# Altium schematic sheet PCB_MCH_mordovia.SchDoc: Mordovia
size 420 x 297 mm; PageSetup: Record=PageOptions|CenterHorizontal=True|CenterVertical=True|PrintScale=0.73|XCorrection==PcbVersion0|YCorrection==PcbVersion0|PrintKind=2|BorderSize=5000000|LeftOffset=0|BottomOffset=0|Orientation=2|PaperLength=1000|PaperWidth=1000|Scale=100|PaperSource=7|PrintQuality=600|MediaType=1|DitherType=10|PaperKind=A4|PrintScaleMode=1; Author: G.K.; CompanyName: WUT; DrawnBy: G.K.; Organization: CERN; Address1: Warsaw Univeristy of Technology; Address2: Nowowiejska 15/19; Revision: -; SheetNumber: -; SheetTotal: -; EDA_Number: ARTIQ; Projet: SINARA; ModifiedBy: -; CreateDate: XX/XX/XXXX; CheckedDate: -; Title2: Tongue 2 adapter; DivGrp: ISE; Designer: G.K.; ModifiedDate: -; ProjectName: SINARA
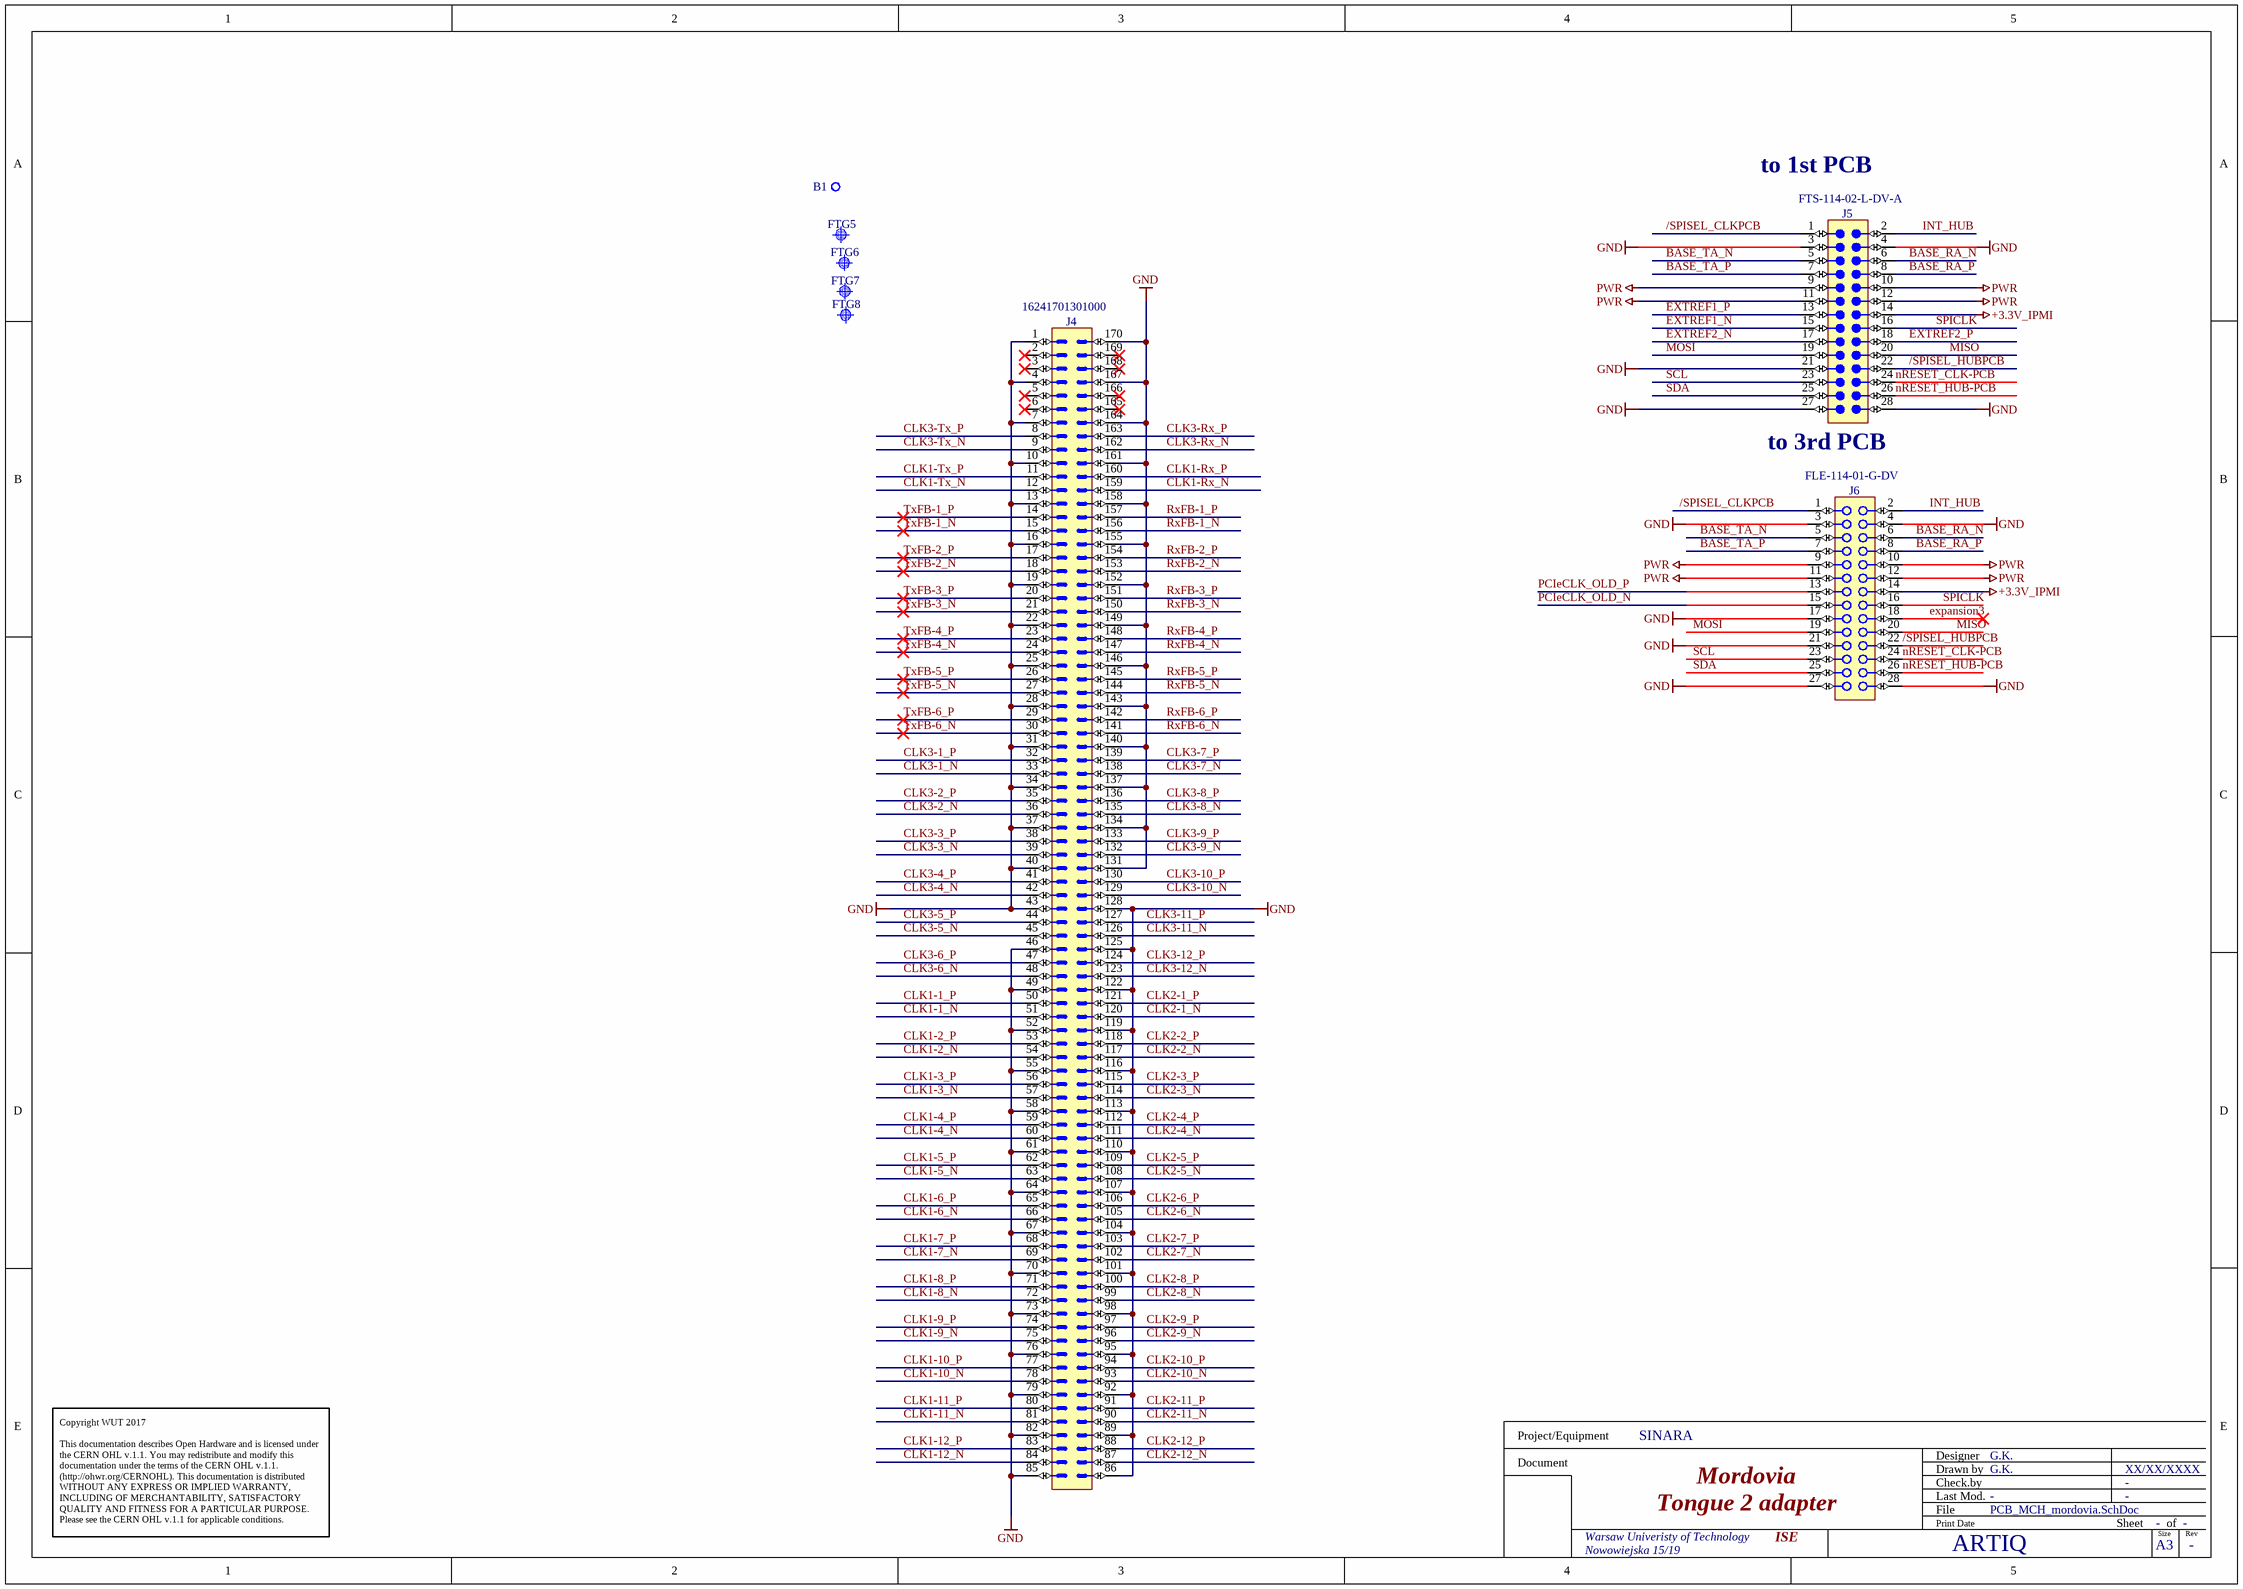
[diagram p0: PCB_MCH_mordovia.SchDoc]

## Parts
B1  Non Plated Hole  [MTG520]  (value not drawn)
FTG5  Use only in PCB  [FIDUCIAL_TOP_C100-200]  (value not drawn)
FTG6  Use only in PCB  [FIDUCIAL_TOP_S100-200]  (value not drawn)
FTG7  Use only in PCB  [FIDUCIAL_TOP_S200-400]  (value not drawn)
FTG8  Use only in PCB  [FIDUCIAL_TOP_S100-200]  (value not drawn)
J4  Manufacturer Part Number: 16241701301000  [ITB_16241701301000]
J5  Manufacturer Part Number: FTS-114-02-L-DV-A  [SAMTEC_FTS-114-02-L-DV-A]  (hidden comment: Header 28)
J6  Manufacturer Part Number: FLE-114-01-G-DV  [SAMTEC_FLE-114-01-G-DV]  (hidden comment: Socket 28)

## Nets
+3.3V_IPMI: J5.14 J6.14
GND: J4.1 J4.4 J4.7 J4.10 J4.13 J4.16 J4.19 J4.22 J4.25 J4.28 J4.31 J4.34 J4.37 J4.40 J4.43 J4.46 J4.49 J4.52 J4.55 J4.58 J4.61 J4.64 J4.67 J4.70 J4.73 J4.76 J4.79 J4.82 J4.85 J4.86 J4.89 J4.92 J4.95 J4.98 J4.101 J4.104 J4.107 J4.110 J4.113 J4.116 J4.119 J4.122 J4.125 J4.128 J4.131 J4.134 J4.137 J4.140 J4.143 J4.146 J4.149 J4.152 J4.155 J4.158 J4.161 J4.164 J4.167 J4.170 J5.3 J5.4 J5.21 J5.27 J5.28 J6.3 J6.4 J6.17 J6.21 J6.27 J6.28
PWR: J5.9 J5.10 J5.11 J5.12 J6.9 J6.10 J6.11 J6.12
/SPISEL_CLKPCB: J5.1 J6.1
/SPISEL_HUBPCB: J5.22 J6.22
BASE_RA_N: J5.6 J6.6
BASE_RA_P: J5.8 J6.8
BASE_TA_N: J5.5 J6.5
BASE_TA_P: J5.7 J6.7
CLK1-1_N: J4.51
CLK1-1_P: J4.50
CLK1-2_N: J4.54
CLK1-2_P: J4.53
CLK1-3_N: J4.57
CLK1-3_P: J4.56
CLK1-4_N: J4.60
CLK1-4_P: J4.59
CLK1-5_N: J4.63
CLK1-5_P: J4.62
CLK1-6_N: J4.66
CLK1-6_P: J4.65
CLK1-7_N: J4.69
CLK1-7_P: J4.68
CLK1-8_N: J4.72
CLK1-8_P: J4.71
CLK1-9_N: J4.75
CLK1-9_P: J4.74
CLK1-10_N: J4.78
CLK1-10_P: J4.77
CLK1-11_N: J4.81
CLK1-11_P: J4.80
CLK1-12_N: J4.84
CLK1-12_P: J4.83
CLK1-Rx_N: J4.159
CLK1-Rx_P: J4.160
CLK1-Tx_N: J4.12
CLK1-Tx_P: J4.11
CLK2-1_N: J4.120
CLK2-1_P: J4.121
CLK2-2_N: J4.117
CLK2-2_P: J4.118
CLK2-3_N: J4.114
CLK2-3_P: J4.115
CLK2-4_N: J4.111
CLK2-4_P: J4.112
CLK2-5_N: J4.108
CLK2-5_P: J4.109
CLK2-6_N: J4.105
CLK2-6_P: J4.106
CLK2-7_N: J4.102
CLK2-7_P: J4.103
CLK2-8_N: J4.99
CLK2-8_P: J4.100
CLK2-9_N: J4.96
CLK2-9_P: J4.97
CLK2-10_N: J4.93
CLK2-10_P: J4.94
CLK2-11_N: J4.90
CLK2-11_P: J4.91
CLK2-12_N: J4.87
CLK2-12_P: J4.88
CLK3-1_N: J4.33
CLK3-1_P: J4.32
CLK3-2_N: J4.36
CLK3-2_P: J4.35
CLK3-3_N: J4.39
CLK3-3_P: J4.38
CLK3-4_N: J4.42
CLK3-4_P: J4.41
CLK3-5_N: J4.45
CLK3-5_P: J4.44
CLK3-6_N: J4.48
CLK3-6_P: J4.47
CLK3-7_N: J4.138
CLK3-7_P: J4.139
CLK3-8_N: J4.135
CLK3-8_P: J4.136
CLK3-9_N: J4.132
CLK3-9_P: J4.133
CLK3-10_N: J4.129
CLK3-10_P: J4.130
CLK3-11_N: J4.126
CLK3-11_P: J4.127
CLK3-12_N: J4.123
CLK3-12_P: J4.124
CLK3-Rx_N: J4.162
CLK3-Rx_P: J4.163
CLK3-Tx_N: J4.9
CLK3-Tx_P: J4.8
expansion3: J6.18
EXTREF1_N: J5.15
EXTREF1_P: J5.13
EXTREF2_N: J5.17
EXTREF2_P: J5.18
INT_HUB: J5.2 J6.2
MISO: J5.20 J6.20
MOSI: J5.19 J6.19
nRESET_CLK-PCB: J5.24 J6.24
nRESET_HUB-PCB: J5.26 J6.26
PCIeCLK_OLD_N: J6.15
PCIeCLK_OLD_P: J6.13
RxFB-1_N: J4.156
RxFB-1_P: J4.157
RxFB-2_N: J4.153
RxFB-2_P: J4.154
RxFB-3_N: J4.150
RxFB-3_P: J4.151
RxFB-4_N: J4.147
RxFB-4_P: J4.148
RxFB-5_N: J4.144
RxFB-5_P: J4.145
RxFB-6_N: J4.141
RxFB-6_P: J4.142
SCL: J5.23 J6.23
SDA: J5.25 J6.25
SPICLK: J5.16 J6.16
TxFB-1_N: J4.15
TxFB-1_P: J4.14
TxFB-2_N: J4.18
TxFB-2_P: J4.17
TxFB-3_N: J4.21
TxFB-3_P: J4.20
TxFB-4_N: J4.24
TxFB-4_P: J4.23
TxFB-5_N: J4.27
TxFB-5_P: J4.26
TxFB-6_N: J4.30
TxFB-6_P: J4.29

Not connected (* = marked no-connect by the designer): B1 1; J4 2(3)* 3(5)* 5(9)* 6(11)* 165* 166* 168* 169*

## Notes on the sheet
- to 1st PCB
- (near J5) to 3rd PCB
- Copyright WUT 2017
  This documentation describes Open Hardware and is licensed under the CERN OHL v.1.1. You may redistribute and modify this documentation under the terms of the CERN OHL v.1.1. (http://ohwr.org/CERNOHL). This documentation is distributed WITHOUT ANY EXPRESS OR IMPLIED WARRANTY, INCLUDING OF MERCHANTABILITY, SATISFACTORY QUALITY AND FITNESS FOR A PARTICULAR PURPOSE. Please see the CERN OHL v.1.1 for applicable conditions.
- Project/Equipment
- Document
- Designer
- Drawn by
- Check.by
- File
- Last Mod.
- Print Date
- Sheet
- Size
- A3
- of
- Rev

## Library data of the parts
B1 = NON-PLATED_HOLE5.2: Single Terminal Socket; Part Description: Non Plated Through Hole: Hole Dia.=5.2mm; Mounted: No; Part Number: NON-PLATED_HOLE5.2; Component Kind: Standard (No BOM); Component Type: Standard (No BOM); Pin Count: 1; Family: Non Plated Hole; Socket: No; SMD: No; Sense: No; Status: None; ComponentHeight: 0mm; HelpURL: Undefined; Author: CERN DEM JMW; CreateDate: 27.09.2011; LatestRevisionDate: 27.09.2011; PackageDescription: Non Plated Through Hole: Hole Dia.=5.2mm
FTG5 = FIDUCIAL_TARGET_C100-200: Fiducial Target; Part Description: Round Fiducial Target, Top Layer, 1.0mm, Top Solder 2.0mm, Keepout =2.0mm; Mounted: No; Part Number: FIDUCIAL_TARGET_C100-200; Component Kind: Standard (No BOM); Component Type: Standard (No BOM); Pin Count: 1; Family: Fiducial; Socket: No; SMD: Yes; Sense: No; Status: None; ComponentHeight: 0mm; HelpURL: Undefined; Author: CERN DEM JLC; CreateDate: 09.02.2010; LatestRevisionDate: 04.04.2012; PackageDescription: Round Fiducial Target, Top Layer, 1.0mm, Top Solder 2.0mm, Keepout =2.0mm
FTG6 FTG8 = FIDUCIAL_TARGET_S100-200: Fiducial Target; Part Description: Square Fiducial Target, Top Layer, 1.0mm, Top Solder 2.0mm, Keepout =2.0mm; Mounted: No; Part Number: FIDUCIAL_TARGET_S100-200; Component Kind: Standard (No BOM); Component Type: Standard (No BOM); Pin Count: 1; Family: Fiducial; Socket: No; SMD: Yes; Sense: No; Status: None; ComponentHeight: 0mm; HelpURL: Undefined; Author: CERN DEM JLC; CreateDate: 09.02.2010; LatestRevisionDate: 04.04.2012; PackageDescription: Square Fiducial Target, Top Layer, 1.0mm, Top Solder 2.0mm, Keepout =2.0mm
FTG7 = FIDUCIAL_TARGET_S200-400: Fiducial Target; Part Description: Square Fiducial Target, Top Layer, 2.0mm, Top Solder 4.0mm, Keepout =4.0mm; Mounted: No; Part Number: FIDUCIAL_TARGET_S200-400; Component Kind: Standard (No BOM); Component Type: Standard (No BOM); Pin Count: 1; Family: Fiducial; Socket: No; SMD: Yes; Sense: No; Status: None; ComponentHeight: 0mm; HelpURL: Undefined; Author: CERN DEM JLC; CreateDate: 02.06.2008; LatestRevisionDate: 04.04.2012; PackageDescription: Square Fiducial Target, Top Layer, 2.0mm, Top Solder 4.0mm, Keepout =4.0mm
J4 = ITB_16241701301000: Connector 170 Male; Part Description: 170 Poles, MCH-Plug Connector (Basic Side); Manufacturer: ITB ADVANCED CONNECTORS; PressFit: No; Part Number: ITB_16241701301000; Component Kind: Standard; Component Type: Standard; Pin Count: 170; Family: AvancedMC; Mounted: Yes; Socket: No; SMD: No; Sense: No; Status: None; ComponentHeight: 7.63mm; HelpURL: \\cern.ch\dfs\Applications\Altium\Datasheets\ITB_16241701301000.pdf; Author: CERN DEM MR; CreateDate: 17.05.2016; LatestRevisionDate: 17.05.2016
J5 = SAMTEC_FTS-114-02-L-DV-A: Connector 28 Male; Part Description: 28 Contacts, Pitch 1.27mm - Dual Row Surface Mount Straight Strip Header; Manufacturer: SAMTEC; PressFit: No; Part Number: SAMTEC_FTS-114-02-L-DV-A; Component Kind: Standard; Component Type: Standard; Pin Count: 28; Family: Header 28; Mounted: Yes; Socket: No; Sense: No; SMD: Yes; Status: None; ComponentHeight: 3.18mm; HelpURL: \\cern.ch\dfs\Applications\Altium\Datasheets\SAMTEC_FTS-114-02-L-DV-A.pdf; Author: CERN DEM MR; CreateDate: 07.03.2016; LatestRevisionDate: 07.03.2016
J6 = SAMTEC_FLE-114-01-G-DV: Connector 28 Female; Part Description: 28 Contacts - Pitch 1.27mm - Dual Row Surface Mount Receptacle; Manufacturer: SAMTEC; PressFit: No; Part Number: SAMTEC_FLE-114-01-G-DV; Component Kind: Standard; Component Type: Standard; Pin Count: 28; Family: Socket 28; Mounted: Yes; Socket: No; Sense: No; SMD: Yes; Status: None; ComponentHeight: 4.55mm; HelpURL: \\cern.ch\dfs\Applications\Altium\Datasheets\SAMTEC_FLE-114-01-G-DV.pdf; Author: CERN DEM MR; CreateDate: 07.03.2016; LatestRevisionDate: 07.03.2016